# Altium schematic sheet EUU.SchDoc
size A3
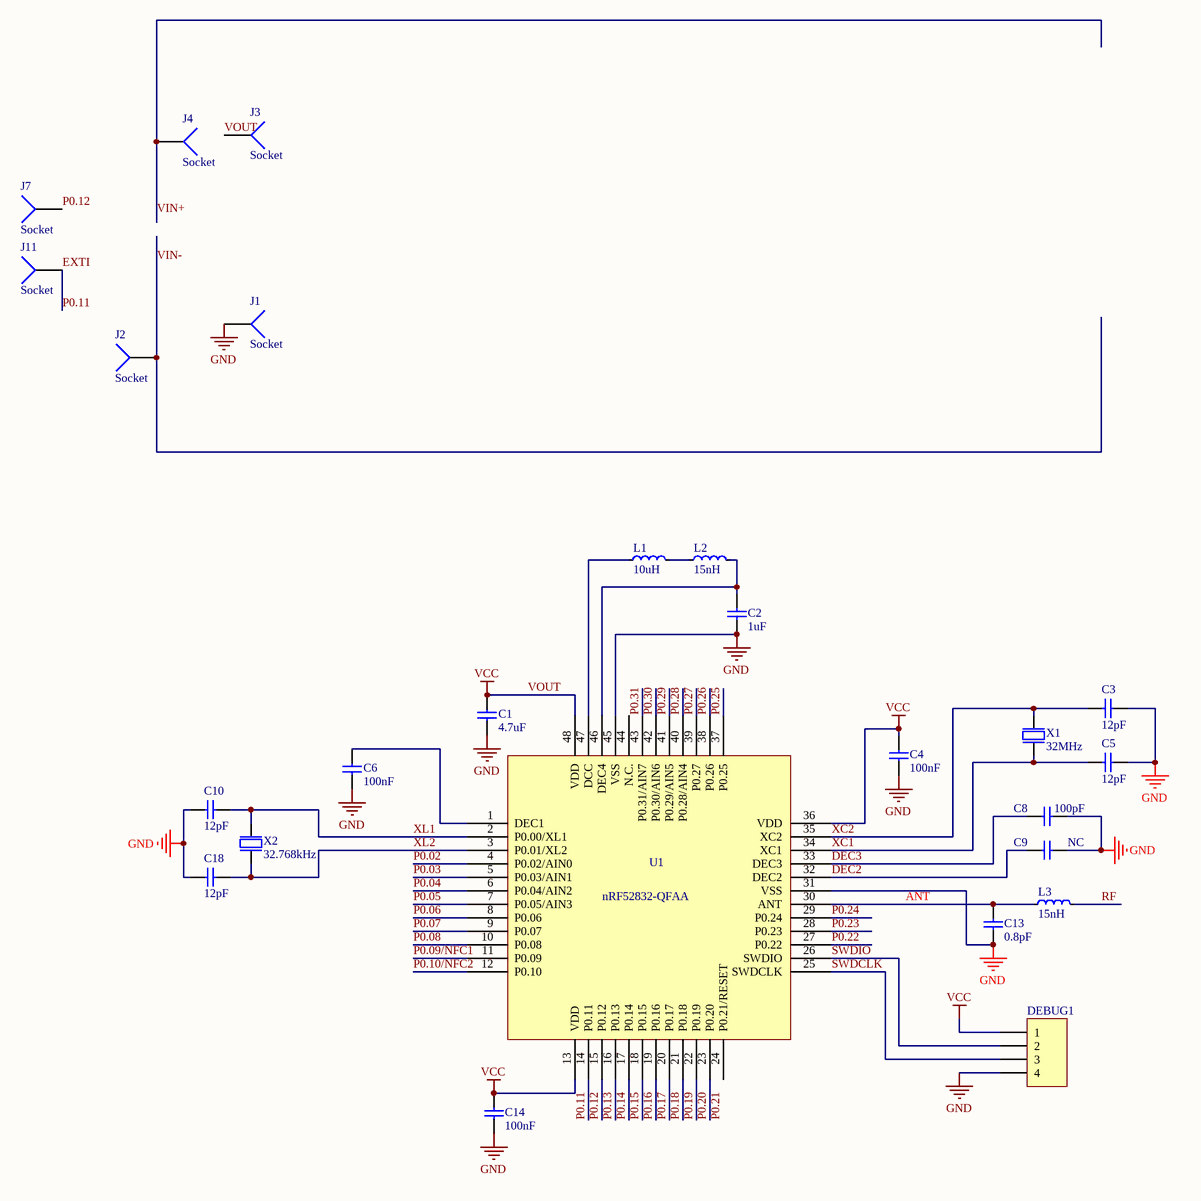
[diagram p0: EUU.SchDoc]

## Parts
C1  4.7uF  [0603C]
C2  1uF  [0603C]
C3  12pF  [0603C]
C4  100nF  [0603C]
C5  12pF  [0603C]
C6  100nF  [0603C]
C8  100pF  [0603C]
C9  NC  [0603C]
C10  12pF  [0603C]
C13  0.8pF  [0603C]
C14  100nF  [0603C]
C18  12pF  [0603C]
DEBUG1  (no value)  [SIP4 - 2.0]
J1  Socket  [PIN1]
J2  Socket  [PIN1]
J3  Socket  [PIN1]
J4  Socket  [PIN1]
J7  Socket  [PIN1]
J11  Socket  [PIN1]
L1  10uH  [0603]
L2  15nH  [0603]
L3  15nH  [0603]
U1  nRF52832-QFAA  [QFN48]
X1  32MHz  [BT-XTAL_2016]
X2  32.768kHz  [XTAL_3215]

## Nets
GND: C1.1 C2.1 C3.2 C4.1 C5.2 C6.2 C8.1 C9.1 C10.1 C13.2 C14.2 C18.1 DEBUG1.4 J1.1 U1.31(VSS) U1.45(VSS) U1.49(GND) X1.2(GND) X1.4(GND)
VOUT: C1.2 C4.2 C14.1 DEBUG1.1 J3.1 U1.13(VDD) U1.36(VDD) U1.48(VDD)  [also labelled VCC]
ANT: C13.1 L3.1 U1.30(ANT)
DEC2: C9.2 U1.32(DEC2)
DEC3: C8.2 U1.33(DEC3)
EXTI: J11.1 U1.14(P0.11)  [also labelled P0.11]
P0.02: U1.4(P0.02/AIN0)
P0.03: U1.5(P0.03/AIN1)
P0.04: U1.6(P0.04/AIN2)
P0.05: U1.7(P0.05/AIN3)
P0.06: U1.8(P0.06)
P0.07: U1.9(P0.07)
P0.08: U1.10(P0.08)
P0.09/NFC1: U1.11(P0.09)
P0.10/NFC2: U1.12(P0.10)
P0.12: J7.1 U1.15(P0.12)
P0.13: U1.16(P0.13)
P0.14: U1.17(P0.14)
P0.15: U1.18(P0.15)
P0.16: U1.19(P0.16)
P0.17: U1.20(P0.17)
P0.18: U1.21(P0.18)
P0.19: U1.22(P0.19)
P0.20: U1.23(P0.20)
P0.22: U1.27(P0.22)
P0.23: U1.28(P0.23)
P0.24: U1.29(P0.24)
P0.25: U1.37(P0.25)
P0.26: U1.38(P0.26)
P0.27: U1.39(P0.27)
P0.28: U1.40(P0.28/AIN4)
P0.29: U1.41(P0.29/AIN5)
P0.30: U1.42(P0.30/AIN6)
P0.31: U1.43(P0.31/AIN7)
RF: L3.2
SWDCLK: DEBUG1.3 U1.25(SWDCLK)
SWDIO: DEBUG1.2 U1.26(SWDIO)
VIN+: J4.1
VIN-: J2.1
XC1: C5.1 U1.34(XC1) X1.1(inp)
XC2: C3.1 U1.35(XC2) X1.3(out)
XL1: C10.2 U1.2(P0.00/XL1) X2.2(out)
XL2: C18.2 U1.3(P0.01/XL2) X2.1(inp)
NetC2_2: C2.2 L2.2 U1.46(DEC4)
NetC6_1: C6.1 U1.1(DEC1)
NetL1_1: L1.1 U1.47(DCC)
NetL1_2: L1.2 L2.1

Not connected (* = marked no-connect by the designer): U1 24(P0.21/RESET) 44(N.C.)

## Notes on the sheet
- Labels drawn without touching a wire or pin: P0.21

## Library data of the parts
C1 C2 C4 C6 C8 C9 = C: Capacitor, NP0, ±2%
C3 C5 C10 C18 = C0402-12p: Capacitor, NP0, ±2%
C13 = C: Capacitor, NP0, ±2%; Part Number: C0402-12p; Note: 50V; Artikkelnr Noca: 20029159; Artikkelnr Simpro: N.A.; Manufacturer: *; Manufacturer Part Number: *; Datasheet: *; LatestRevisionDate: 2011-05-11; Pin Count: 2; Publisher: Nordic Semiconductor; Published: 2009-05-08; Value: 0.8pF; Supplier: *; Supplier part number: *; 2nd source Supplier: *; 2nd source part number: *; Footprint Doc: 0402
C14 = C: Capacitor, NP0, ±2%; Part Number: C0402-12p; Value: 12pF; Note: 50V; Artikkelnr Noca: 20029159; Artikkelnr Simpro: N.A.; Manufacturer: *; Manufacturer Part Number: *; Datasheet: *; LatestRevisionDate: 2011-05-11; Pin Count: 2; Publisher: Nordic Semiconductor; Published: 2009-05-08; Supplier: *; Supplier part number: *; 2nd source Supplier: *; 2nd source part number: *; Footprint Doc: 0402
DEBUG1 = Header 4: LatestRevisionDate: 17-Jul-2002; LatestRevisionNote: Re-released for DXP Platform.; Publisher: Altium Limited
L1-L3 = L: High frequency chip inductor ±5%
U1 = nRF52832_QFAA: Multi-protocol Bluetooth Low Energy and 2.4GHz proprietary system-on-chip
X1 = XTAL_SMD2016_32MHz_8pF_Epson: XTAL SMD 2016, 32MHz, Cl=8pF, Tol: ±10ppm, Stab: ±10ppm; Manufacturer: Epson Toyocom; Manufacturer Part Number: Q22FA12800025; Note: XTAL SMD 32.000MHz; Artikkelnr Noca: N.A.; Part Number: XTAL_SMD2016_32MHz_8pF_Epson; Datasheet: http://www.epsondevice.com/docs/qd/en/DownloadServlet?id=ID000449; LatestRevisionDate: 2014-11-27; Pin Count: 4; Publisher: Nordic Semiconductor; Published: 2012-03-09; Value: 32MHz; Supplier: Farnell; Supplier part number: 171-2806; 2nd source Supplier: *; 2nd source part number: *; Footprint Doc: XTAL_2016; Artikkelnr Simpro: N.A.
X2 = XTAL_FC-135 32.768k: EPSON TOYOCOM - FC-135 32.768KHZ ±20PPM,9.0PF - CRYSTAL, SM, WATCH
J1-J4 J7 J11 = Socket: LatestRevisionDate: 17-Jul-2002; LatestRevisionNote: Re-released for DXP Platform.; Publisher: Altium Limited